# Altium schematic sheet Block diagram.SchDoc
size A4; SheetNumber: 2; SheetTotal: 10
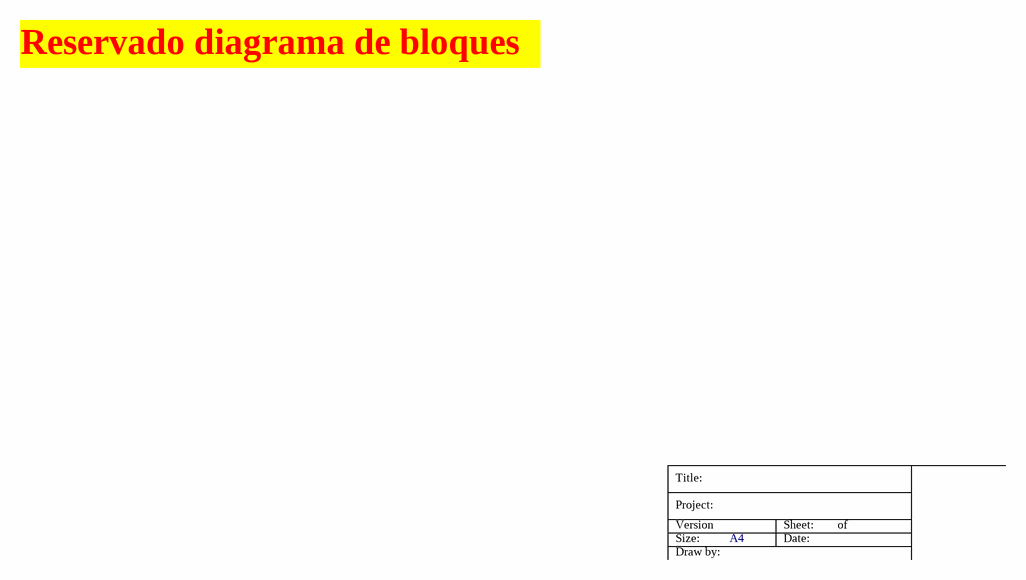
[diagram p0: Block diagram.SchDoc]

## Notes on the sheet
- Reservado diagrama de bloques
- Title:
- Project:
- Version
- Size:
- A4
- Sheet:
- Date:
- of
- Draw by: